# EAGLE schematic ADE9153A_Ic (EAGLE 9.6.2)
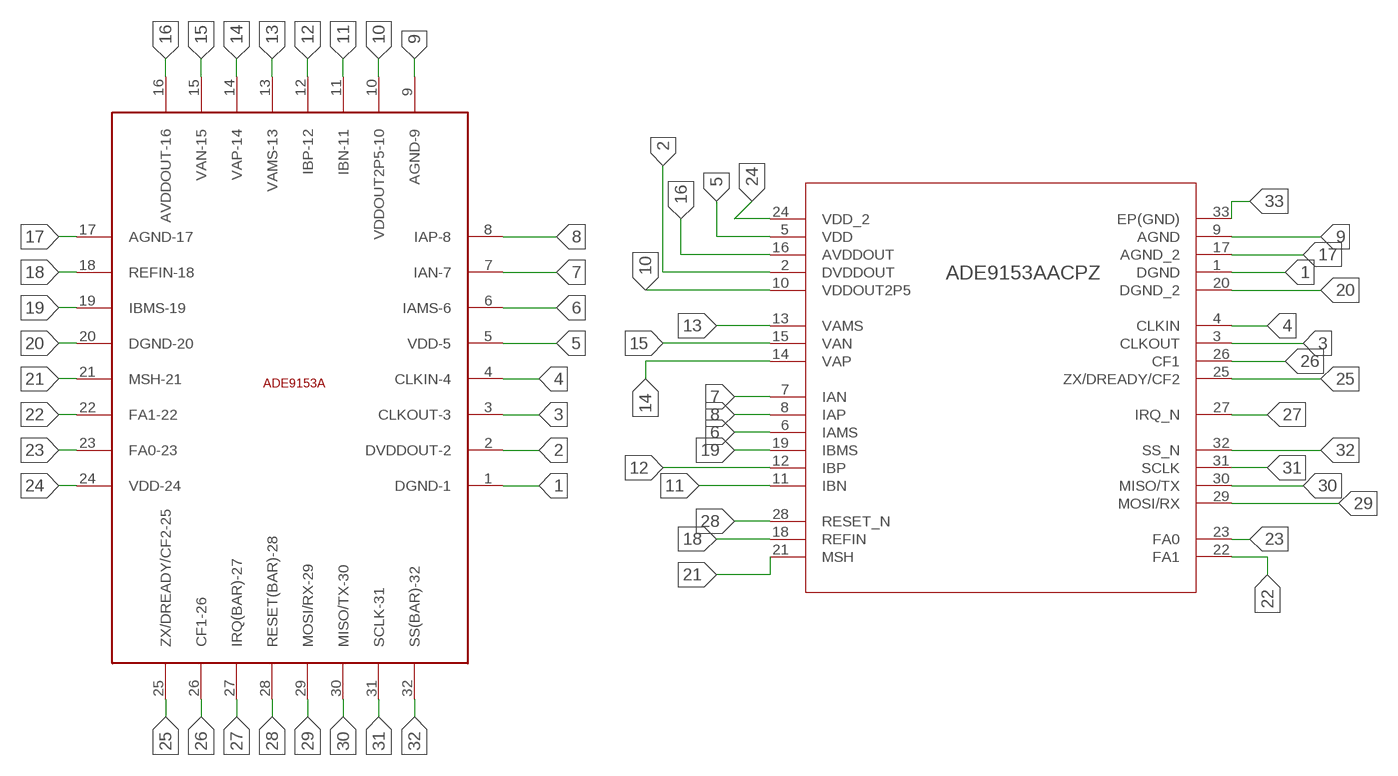
[diagram p0: schematic, sheet 1]

## Parts
U$1  ADE9153AACPZ  [QFN50P500X500X80-33N]
U$2  ADE9153A_BASEADE9153A_BASE  [ADE9153A_BASE]

## Nets
1: U$1.1(DGND) U$2.1(DGND-1)
2: U$1.2(DVDDOUT) U$2.2(DVDDOUT-2)
3: U$1.3(CLKOUT) U$2.3(CLKOUT-3)
4: U$1.4(CLKIN) U$2.4(CLKIN-4)
5: U$1.5(VDD) U$2.5(VDD-5)
6: U$1.6(IAMS) U$2.6(IAMS-6)
7: U$1.7(IAN) U$2.7(IAN-7)
8: U$1.8(IAP) U$2.8(IAP-8)
9: U$1.9(AGND) U$2.9(AGND-9)
10: U$1.10(VDDOUT2P5) U$2.10(VDDOUT2P5-10)
11: U$1.11(IBN) U$2.11(IBN-11)
12: U$1.12(IBP) U$2.12(IBP-12)
13: U$1.13(VAMS) U$2.13(VAMS-13)
14: U$1.14(VAP) U$2.14(VAP-14)
15: U$1.15(VAN) U$2.15(VAN-15)
16: U$1.16(AVDDOUT) U$2.16(AVDDOUT-16)
17: U$1.17(AGND_2) U$2.17(AGND-17)
18: U$1.18(REFIN) U$2.18(REFIN-18)
19: U$1.19(IBMS) U$2.19(IBMS-19)
20: U$1.20(DGND_2) U$2.20(DGND-20)
21: U$1.21(MSH) U$2.21(MSH-21)
22: U$1.22(FA1) U$2.22(FA1-22)
23: U$1.23(FA0) U$2.23(FA0-23)
24: U$1.24(VDD_2) U$2.24(VDD-24)
25: U$1.25(ZX/DREADY/CF2) U$2.25(ZX/DREADY/CF2-25)
26: U$1.26(CF1) U$2.26(CF1-26)
27: U$1.27(IRQ_N) U$2.27(IRQ(BAR)-27)
28: U$1.28(RESET_N) U$2.28(RESET(BAR)-28)
29: U$1.29(MOSI/RX) U$2.29(MOSI/RX-29)
30: U$1.30(MISO/TX) U$2.30(MISO/TX-30)
31: U$1.31(SCLK) U$2.31(SCLK-31)
32: U$1.32(SS_N) U$2.32(SS(BAR)-32)
33: U$1.33(EP(GND))

## Library data of the parts
U$1 = ADE9153AACPZ:ADE9153AACPZ: Check availability <https://pricing.snapeda.com/parts/ADE9153AACPZ/Analog%20Devices/view-part?ref=eda>; AVAILABILITY: In Stock; DESCRIPTION: Energy Metering IC with Autocalibration; MF: Analog Devices; MP: ADE9153AACPZ; PACKAGE: LFCSP -32 Analog Devices; PRICE: None; PURCHASE-URL: https://pricing.snapeda.com/search/part/ADE9153AACPZ/?ref=eda
U$2 = ADE9153A_base:ADE9153A_BASE